# EAGLE design BrainA2-A-24Sep2016 (EAGLE 7.5.0)
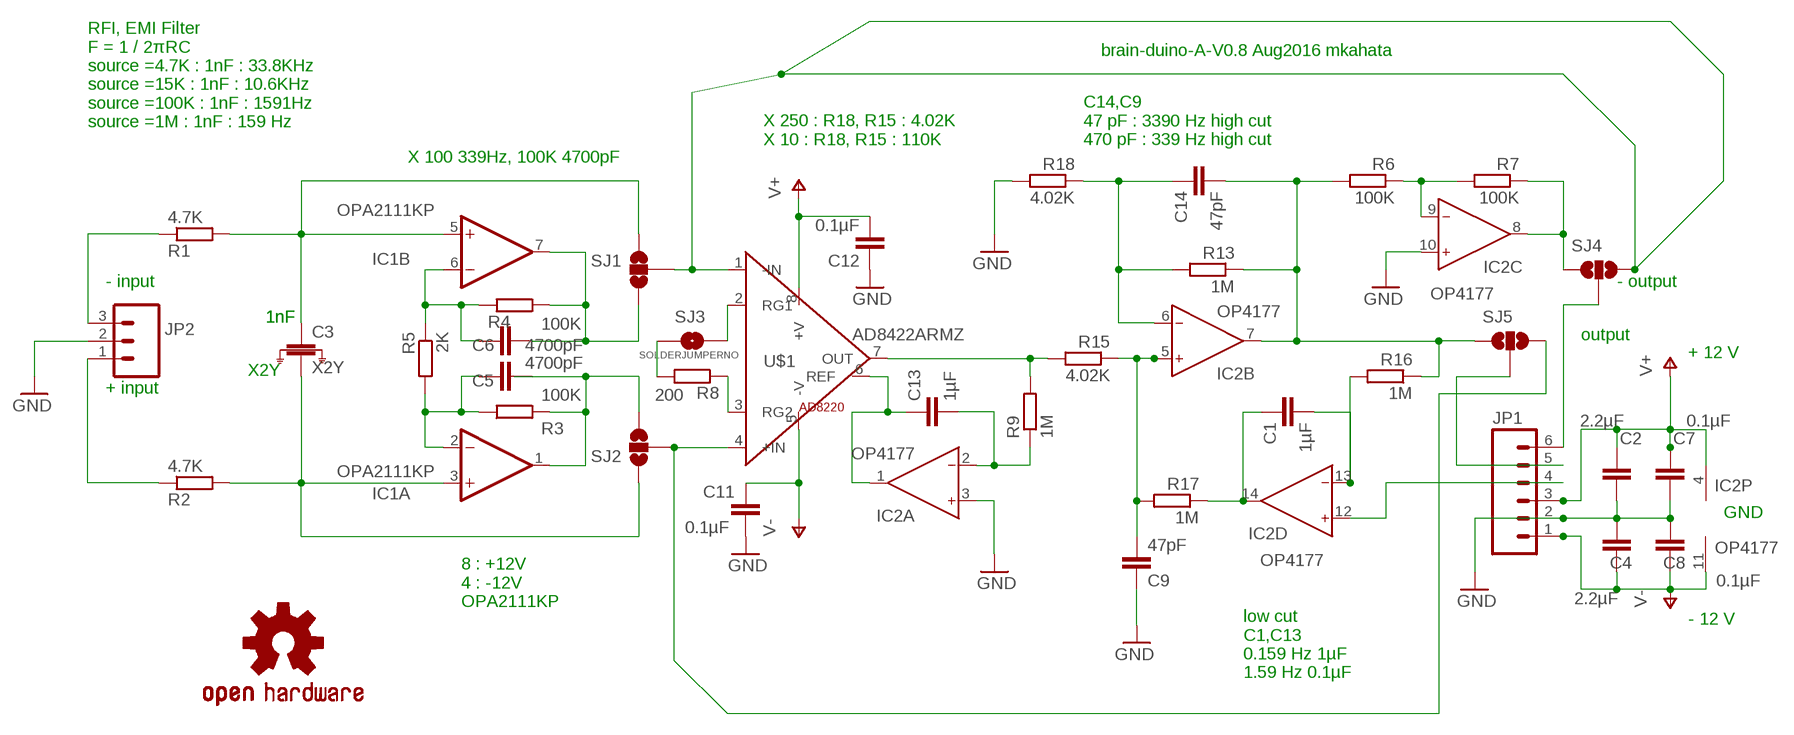
[diagram p0: schematic, sheet 1]

## Parts
C1  1µF  C-EUC0402  [C0402]
C2  2.2µF  C-EUC0402  [C0402]
C3  X2Y  C-EUX2Y  [C0603]
C4  2.2µF  C-EUC0402  [C0402]
C5  4700pF  C-EUC0402  [C0402]
C6  4700pF  C-EUC0402  [C0402]
C7  0.1µF  C-EUC0402  [C0402]
C8  0.1µF  C-EUC0402  [C0402]
C9  47pF  C-EUC0402  [C0402]
C11  0.1µF  C-EUC0402  [C0402]
C12  0.1µF  C-EUC0402  [C0402]
C13  1µF  C-EUC0402  [C0402]
C14  47pF  C-EUC0402  [C0402]
IC1  OPA2111KP  OPA2111P  [DIL08]
IC2  OP4177  AD8544RU  [TSSOP14]
JP1  M06SILK_FEMALE_PTH  [1X06]
JP2  M03PTH  [1X03]
LOGO1  OSHW-LOGOS  [OSHW-LOGO-S]
R1  4.7K  R-EU_R0402  [R0402]
R2  4.7K  R-EU_R0402  [R0402]
R3  100K  R-EU_R0402  [R0402]
R4  100K  R-EU_R0402  [R0402]
R5  2K  R-EU_R0402  [R0402]
R6  100K  R-EU_R0402  [R0402]
R7  100K  R-EU_R0402  [R0402]
R8  200  R-EU_R0402  [R0402]
R9  1M  R-EU_R0402  [R0402]
R13  1M  R-EU_R0402  [R0402]
R15  4.02K  R-EU_R0402  [R0402]
R16  1M  R-EU_R0402  [R0402]
R17  1M  R-EU_R0402  [R0402]
R18  4.02K  R-EU_R0402  [R0402]
SJ1  SOLDERJUMPER_2WAYPASTE2&3  [SJ_3_PASTE2&3]
SJ2  SOLDERJUMPER_2WAYPASTE2&3  [SJ_3_PASTE2&3]
SJ3  SOLDERJUMPERNO  [SJ_2S-NO]
SJ4  SOLDERJUMPER_2WAYPASTE2&3  [SJ_3_PASTE2&3]
SJ5  SOLDERJUMPER_2WAYPASTE2&3  [SJ_3_PASTE2&3]
U$1  AD8422ARMZ  AD8220  [AD8220]

## Nets
GND: C2.1 C4.2 C7.1 C8.2 C9.1 C11.2 C12.1 IC2.3(A:IN+) IC2.10(C:IN+) JP1.2 JP2.2 R18.2
N$1: JP2.3 R1.1
N$2: R8.2 SJ3.1
N$3: JP2.1 R2.1
N$4: C3.2 IC1.3(A:+IN) R2.2 SJ2.1
N$5: C3.1 IC1.5(B:+IN) R1.2 SJ1.1
N$6: IC2.9(C:IN-) R6.1 R7.2
N$8: C5.1 IC1.2(A:-IN) R3.1 R5.2
N$9: C6.1 IC1.6(B:-IN) R4.1 R5.1
N$14: SJ1.2 SJ4.1 U$1.1(-IN)
N$15: SJ2.2 SJ5.1 U$1.4(+IN)
N$17: C5.2 IC1.1(A:OUT) R3.2 SJ2.3
N$18: C6.2 IC1.7(B:OUT) R4.2 SJ1.3
N$19: R8.1 U$1.3(RG2)
N$20: JP1.6 SJ4.2
N$21: C1.2 IC2.13(D:IN-) R16.2
N$23: SJ3.2 U$1.2(RG1)
N$24: C9.2 IC2.5(B:IN+) R15.1 R17.2
N$25: R9.2 R15.2 U$1.7(OUT)
N$26: C13.2 IC2.2(A:IN-) R9.1
N$29: C14.2 IC2.7(B:OUT) R6.2 R13.1 R16.1 SJ5.3
N$30: C13.1 IC2.1(A:OUT) U$1.6(REF)
N$31: C14.1 IC2.6(B:IN-) R13.2 R18.1
N$34: IC2.12(D:IN+) JP1.4
N$35: C1.1 IC2.14(D:OUT) R17.1
N$36: IC2.8(C:OUT) R7.1 SJ4.3
N$38: JP1.5 SJ5.2
V+: C2.2 C7.2 C12.2 IC2.4(P:V+) JP1.3 U$1.8(+V)
V-: C4.1 C8.1 C11.1 IC2.11(P:V-) JP1.1 U$1.5(-V)

## Notes on the sheet
- brain-duino-A-V0.8 Aug2016 mkahata
- RFI, EMI Filter
  F = 1 / 2πRC
  source =4.7K : 1nF : 33.8KHz
  source =15K : 1nF : 10.6KHz
  source =100K : 1nF : 1591Hz
  source =1M : 1nF : 159 Hz
- X 250 : R18, R15 : 4.02K
  X 10 : R18, R15 : 110K
- C14,C9
  47 pF : 3390 Hz high cut
  470 pF : 339 Hz high cut
- X 100 339Hz, 100K 4700pF
- - input | - output
- 1nF | 1nF
- output
- + 12 V
- X2Y
- + input
- GND
- 8 : +12V
  4 : -12V
  OPA2111KP
- - 12 V
- low cut
  C1,C13
  0.159 Hz 1µF
  1.59 Hz 0.1µF

## Power pins joined to a net without a drawn wire
GND: C3.GND
V+: IC1.8(P:V+)
V-: IC1.4(P:V-)

## Library data of the parts
C1 C2 C4-C9 C11-C14 = resistor:C-EU: CAPACITOR, European symbol
C3 = AD7173:C-EU: CAPACITOR, European symbol
IC1 = linear:OPA2111: OP AMP
IC2 = analog-devices:AD8544: General-Purpose CMOS Rail-to-Rail Amplifiers Source: http://www.analog.com/static/imported-files/data_sheets/AD8541_8542_8544.pdf; MPN: AD8544ARUZ; OC_FARNELL: unknown; OC_NEWARK: 15P1001
JP1 = SparkFun-Connectors:M06: Header 6 Standard 6-pin 0.1" header. Use with straight break away headers (SKU : PRT-00116), right angle break away headers (PRT-00553), swiss pins (PRT-00743), machine pins (PRT-00117), and female headers (PRT-00115). Molex polarized connector foot print use with SKU : PRT-08094 with associated crimp pins and housings. NOTES ON THE VARIANTS LOCK and LOCK_LONGPADS... This footprint was designed to help hold the alignment of a through-hole component (i.e. 6-pin header) while soldering it into place. You may notice that each hole has been shifted either up or down by 0.005 of an inch from it's more standard position (which is a perfectly straight line). This slight alteration caused the pins (the squares in the middle) to touch the edges of the holes. Because they are alternating, it causes a "brace" to hold the component in place. 0.005 has proven to be the perfect amount of "off-center" position when using our standard breakaway headers. Although looks a little odd when you look at the bare footprint, once you have a header in there, the alteration is very hard to notice. Also,if you push a header all the way into place, it is covered up entirely on the bottom side. This idea of altering the position of holes to aid alignment will be further integrated into the Sparkfun Library for other footprints. It can help hold any component with 3 or more connection pins.; PROD_ID: CONN-08437
JP2 = SparkFun-Connectors:M03: Header 3 Standard 3-pin 0.1" header. Use with straight break away headers (SKU : PRT-00116), right angle break away headers (PRT-00553), swiss pins (PRT-00743), machine pins (PRT-00117), and female headers (PRT-00115). Molex polarized connector foot print use with SKU : PRT-08232 with associated crimp pins and housings.
LOGO1 = SparkFun-Aesthetics:OSHW-LOGO: Open Source Hardware Logo This logo indicates the piece of hardware it is found on incorporates a OSHW license and/or adheres to the definition of open source hardware found here: http://freedomdefined.org/OSHW
R1-R9 R13 R15-R18 = resistor:R-EU_: RESISTOR, European symbol
SJ1 SJ2 SJ4 SJ5 = SparkFun-Retired:SOLDERJUMPER_2WAY: Solder Jumper 2 way solder jumper
SJ3 = SparkFun-Retired:SOLDERJUMPER: Solder Jumper Standard SMD solder jumper. Used to automate production. Two varients : Normally Open and Normally Closed are the same, but have different paste layers. NC will have a large amount of paste and should jumper during reflow.
U$1 = MKH:AD8220: IN-AMP{

## Net classes
0 default: clearance 0.205 mm

## Board
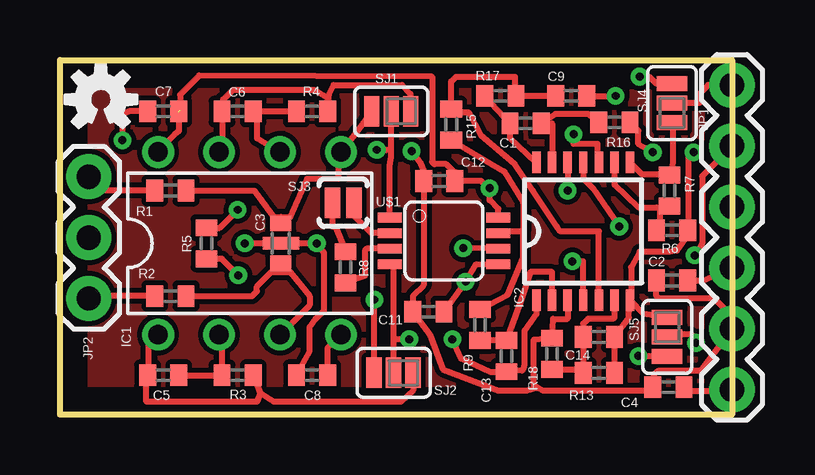
[diagram p1: board, top side]
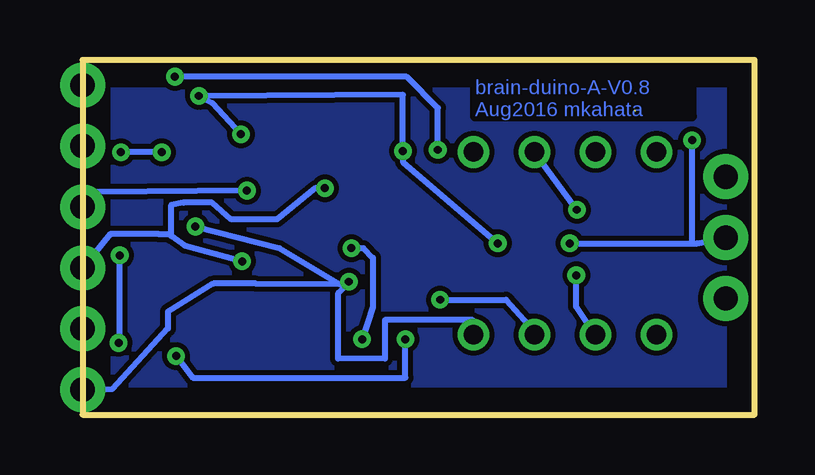
[diagram p2: board, bottom side, seen from below]

Size 28 x 14.8 mm. Coordinates in mm from the lower left corner, seen from the top.
Outline: 0,14.8 28,14.8 28,0 0,0 0,14.8
Copper layers (1*16): Top 0.035mm / dielectric 1.5mm / Bottom 0.035mm
Design rules "default *": minimum track width 10mil, minimum drill 24mil, track to track 8mil, track to pad 8mil, pad to pad 8mil, via to via 8mil, smd to smd 8mil, copper to edge 40mil, drill to drill 8mil, minimum pad ring 10mil, minimum via ring 8mil, stop-mask expansion 4mil, vias tented up to drill 0mil, thermal gap 10mil

### Footprints (pad centres in the part's own frame; a part is rotated, then mirrored left to right if it is on the bottom)
C0402 = smd 0.7 x 0.9: 1 -0.65,0; 2 0.65,0
C0603 = smd 0.64 x 0.89: 1 -0.83,0; 2 0.83,0 | smd 0.51 x 1.52: GND 0,0
DIL08 = drill 0.813 pad 1.27: 1 -3.81,-3.81; 2 -1.27,-3.81; 3 1.27,-3.81; 4 3.81,-3.81; 5 3.81,3.81; 6 1.27,3.81; 7 -1.27,3.81; 8 -3.81,3.81
TSSOP14 = smd 0.9 x 0.35: 1 -2.875,1.95; 2 -2.875,1.3; 3 -2.875,0.65; 4 -2.875,0; 5 -2.875,-0.65; 6 -2.875,-1.3; 7 -2.875,-1.95; 8 2.875,-1.95; 9 2.875,-1.3; 10 2.875,-0.65; 11 2.875,0; 12 2.875,0.65; 13 2.875,1.3; 14 2.875,1.95
1X06 = drill 1.016 pad 1.88: 1 0,0; 2 2.54,0; 3 5.08,0; 4 7.62,0; 5 10.16,0; 6 12.7,0
1X03 = drill 1.016 pad 1.88: 1 0,0; 2 2.54,0; 3 5.08,0
R0402 = smd 0.7 x 0.9: 1 -0.65,0; 2 0.65,0
SJ_3_PASTE2&3 = smd 0.635 x 1.27: 1 -0.813,0; 2 0,0; 3 0.813,0
SJ_2S-NO = smd 0.635 x 1.27: 1 -0.45,0; 2 0.45,0
AD8220 = smd 0.4 x 1: 1 -0.976,-2.263; 2 -0.326,-2.263; 3 0.324,-2.263; 4 0.974,-2.263; 5 0.974,2.262; 6 0.324,2.262; 7 -0.326,2.262; 8 -0.976,2.262

### Placement (x,y rotation side)
C1  19.4,12.15 0 top
C2  25.5,5.6 0 top
C3  9.2,7.15 270 top
C4  25.35,1.15 180 top
C5  4.3,1.65 180 top
C6  7.4,12.65 180 top
C7  4.3,12.65 0 top
C8  10.5,1.65 180 top
C9  21.3,13.3 180 top
C11  15.35,4.3 180 top
C12  15.8,9.75 0 top
C13  18.6,2.45 90 top
C14  22.45,3.25 0 top
IC1  7.9,7.15 0 top
IC2  21.8,7.65 90 top
JP1  28,1.05 90 top
JP2  1.2,4.85 90 top
LOGO1  1.7,13.15 0 top
R1  4.6,9.35 0 top
R2  4.6,4.95 0 top
R3  7.4,1.65 0 top
R4  10.5,12.65 0 top
R5  6.1,7.15 270 top
R6  25.5,7.7 0 top
R7  25.4,9.35 270 top
R8  11.9,6.15 90 top
R9  17.5,3.75 90 top
R13  22.45,1.75 180 top
R15  16.3,12.1 270 top
R16  23.1,12.2 180 top
R17  18.35,13.3 0 top
R18  20.5,2.55 90 top
SJ1  13.8,12.65 0 top
SJ2  13.9,1.75 0 top
SJ3  11.8,8.85 0 top
SJ4  25.5,13 270 top
SJ5  25.3,3.25 90 top
U$1  16,7.25 270 top

### Tracks (layer width: path | path; a pad name or v marks a point on that pad's centre or on a via)
GND  (via drill 0.33)
  Top 0.254: IC2.3 21.15,4 20.55,4 R18.2 19.74,3.14 19.74,1.23 | 19.74,1.23 19.87,1.12 19.45,1 18.3,1 15.95,1.9 15.4,3.35 C11.2 14.7,4.95 15.15,5.4 C12.1 15.15,10.2 15.05,10.45 v14.65,11 | v2.6,11.45 2.6,12.55 2.92,12.67 3.47,12.67 3.49,12.65 C7.1 | IC2.10 22.45,10.7 22.4,10.75 22.4,11.3 21.4,11.3 v21.4,11.7 21.4,11.75 | C8.2 10.4,2.65 10.4,3.65 10.65,4 11,4.35 11,6.75 v10.7,7.15 C3.GND v7.7,7.15 | 19.74,1.23 20.12,1 24.55,1 24.7,1.2 C4.2 24.75,1.7 24.95,1.85 26.71,1.85 JP1.2 28,4.1 27.25,4.85 24.95,4.85 24.85,4.95 C2.1 | C9.1 v23.15,13.3
  Bottom 0.254: 2.6,7.15 v2.6,11.45 | v7.7,7.15 2.6,7.15 | 2.6,7.15 2.4,7.15 JP2.2 | v10.7,7.15 14.65,10.55 v14.65,11 14.65,13.35 v23.15,13.3 22.6,13 v21.4,11.7
N$1
  Top 0.254: R1.1 1.74,9.35 1.36,9.63 JP2.3
N$2
  Top 0.254: R8.2 11.49,7.81 11.35,7.85 SJ3.1
N$3
  Top 0.254: R2.1 1.74,4.95 1.5,4.91 JP2.1
N$4  (via drill 0.33)
  Top 0.254: 9.2,5.95 8.8,5.95 8.2,5.35 8.2,5.15 8,4.95 R2.2 | 9.2,5.95 9.6,5.95 10.4,4.95 10.4,4.57 IC1.3 | C3.2 9.2,5.95 | SJ2.1 13.09,3.66 v13.1,4.8
  Bottom 0.254: v13.1,4.8 10.35,4.8 9.4,3.75 9.2,3.57 IC1.3
N$5
  Top 0.254: R1.2 8.1,9.35 8.9,8.25 9.2,8.25 | 9.2,8.25 9.6,8.25 10.3,9.85 11.6,9.85 11.6,10.85 IC1.5 12.4,11.85 SJ1.1 | C3.1 9.2,8.25
N$6
  Top 0.254: IC2.9 23.1,9.6 24.1,8.65 24.85,8.65 R7.2 25,8.5 25,7.4 R6.1
N$8  (via drill 0.33)
  Top 0.254: C5.1 R3.1 6.75,3.02 IC1.2 | v7.43,5.81 6.74,6.5 R5.2
  Bottom 0.254: IC1.2 7.43,4.51 v7.43,5.81
N$9  (via drill 0.33)
  Top 0.254: 9.02,11.05 IC1.6 8.97,11.06 8.22,11.52 8.22,12.61 C6.1 R4.1 | R5.1 6.65,7.8 v7.4,8.55
  Bottom 0.254: v7.4,8.55 7.46,8.6 IC1.6
N$10
  pour Bottom: 0,14.8 28,14.8 28,0 0,0
N$11
  pour Top: 0,14.8 28,14.8 28,0 0,0
N$14  (via drill 0.33)
  Top 0.254: U$1.1 13.74,10.39 13.8,10.75 13.8,11.1 | 13.8,11.1 SJ1.2 | SJ4.1 24.84,13.81 24.55,14.1 v24.15,14.1 | v13.2,11.05 13.6,11.05 13.8,11.1
  Bottom 0.254: v13.2,11.05 13.2,12.8 14.5,14.1 v24.15,14.1
N$15  (via drill 0.33)
  Top 0.254: SJ2.2 13.9,3.15 | 13.9,3.15 13.9,6.11 U$1.4 | v14.55,3.15 13.9,3.15 | v24.1,2.45 25.29,2.45 SJ5.1
  Bottom 0.254: v24.1,2.45 23.4,1.55 14.55,1.55 v14.55,3.15
N$17
  Top 0.254: R3.2 8.35,0.9 | 8.35,0.9 8.2,0.55 3.6,0.55 3.6,1.5 C5.2 3.65,1.93 3.68,1.93 3.7,1.95 3.7,2.95 IC1.1 | 8.35,0.9 8.9,0.55 14.2,0.55 14.71,1.01 SJ2.3
N$18
  Top 0.254: 6.91,12.44 C6.2 | C6.2 6.8,12.5 6.8,13.15 7.2,13.55 10.6,13.55 11.15,13.2 R4.2 11.2,12.65 11.2,13.35 11.4,13.75 14.25,13.75 14.6,13.39 SJ1.3 | C6.2 6.75,11.08 IC1.7
N$19
  Top 0.254: U$1.3 12.78,6.93 12.7,6.85 12.7,5.8 11.95,5.55 R8.1
N$20
  Top 0.254: JP1.6 27,13.75 26.65,13.4 26.65,13 SJ4.2
N$21
  Top 0.254: IC2.13 20.5,12.15 C1.2 20.65,12.55 22,12.55 R16.2
N$23
  Top 0.254: U$1.2 12.97,7.58 12.3,8.25 12.3,8.45 | 12.3,8.45 12.3,9.04 | SJ3.2 12.35,8.5 12.3,8.45
N$24
  Top 0.254: IC2.5 22.45,7.65 20.85,7.65 20.7,7.85 19.7,9.35 18.95,10.45 17.55,11.65 17.05,12.6 16.45,12.6 | C9.2 R17.2 19.1,13.5 18.95,13.8 18.95,14.1 16.5,14.1 16.3,13.9 16.3,12.65 16.35,12.6 16.45,12.6 | 16.45,12.6 R15.1
N$25
  Top 0.254: 19.3,7.65 18.34,7.65 U$1.7 | R9.2 18.65,5 19.3,6.55 19.3,7.65 | R15.2 18.5,10.15 19.3,8.85 19.3,7.65
N$26
  Top 0.254: IC2.2 20.5,5.95 19.6,5.95 19.2,4.75 C13.2 R9.1
N$29  (via drill 0.33)
  Top 0.254: R13.1 C14.2 23.7,4.05 23.7,4.33 IC2.7 | IC2.7 23.8,4.83 23.8,6.15 24.15,6.8 25.4,6.8 25.7,6.85 26.15,7.5 R6.2 26.2,7.5 26.2,10.9 v26.4,10.95 | v24.7,10.95 24.1,11.3 24.1,11.85 R16.1 | IC2.7 24.31,4.21 SJ5.3
  Bottom 0.254: v24.7,10.95 v26.4,10.95
N$30  (via drill 0.33)
  Top 0.254: U$1.6 17.88,6.93 16.9,6.95 v16.8,6.95 | v16.35,3.15 16.7,2.35 17.9,1.8 C13.1 | 18.85,1.75 C13.1 | IC2.1 19.85,4.2 19.35,3.5 19.35,2.1 19.3,1.9 19.25,1.85 C13.1
  Bottom 0.254: v16.35,3.15 15.9,4.5 15.9,6.55 16.3,6.95 v16.8,6.95
N$31
  Top 0.254: R18.1 21.5,1.9 R13.2 C14.1 21.8,3.8 22,4 23.05,4 23.1,4.05 IC2.6
N$34  (via drill 0.33)
  Top 0.254: IC2.12 v21.15,9.35
  Bottom 0.254: v21.15,9.35 27.37,9.3 JP1.4
N$35
  Top 0.254: R17.1 C1.1 18.75,11.55 IC2.14
N$36
  Top 0.254: 25.28,10.02 25.53,10.33 25.55,10.6 25.55,12.14 SJ4.3 | 25.28,10.02 24.25,10.02 IC2.8 | R7.1 25.3,10 25.28,10.02
N$38  (via drill 0.33 pad 0.25)
  Top 0.254: JP1.5 26.75,9.95 26.75,7.15 26.6,6.8 v26.45,6.65 | v26.5,3 26.5,3.15 26.3,3.35 25.6,3.35 SJ5.2
  Bottom 0.254: v26.5,3 26.45,3.15 v26.45,6.65
V+  (via drill 0.33)  (1 unrouted)
  Top 0.254: IC1.8 4.16,11.06 4.78,11.7 4.95,11.83 C7.2 | U$1.8 18.26,8.59 17.9,8.95 v17.9,9.45 17.85,9.45 17.55,9.75 C12.2 16.45,10.1 | 5,12.7 5,13.35 5.8,14.15 15.5,14.1 15.5,10.55 15.6,10.45 16.1,10.45 16.45,10.1 | IC2.4 21.8,6.4 v21.35,6.4 | C2.2 26.82,5.6 JP1.3 | 16.55,10.1 16.45,10.1
  Bottom 0.254: v21.35,6.4 23.73,7.05 24.3,7.45 | v17.9,9.45 18.3,9.45 19.9,8.15 21.8,8.15 22.6,8.85 23.8,8.85 24.3,8.75 24.3,7.45 | 24.3,7.45 24.4,7.55 24.82,7.53 26.85,7.53 JP1.3
V-  (via drill 0.33)
  Top 0.254: C11.1 v16.9,5.55 17.35,6.29 U$1.5 | v23.3,7.85 22.2,9.45 21.8,9.85 IC2.11 | C4.1 25.9,0.99 27.94,0.99 JP1.1 | C8.1 11.15,2.78 IC1.4
  Bottom 0.254: IC1.4 11.75,3.34 11.75,3.95 15.4,3.95 15.4,2.35 17.35,2.34 17.34,5.09 v16.9,5.55 17.3,5.45 | v23.3,7.85 19.8,6.95 17.3,5.45 | 17.3,5.45 20.78,5.47 22.55,5.47 24.45,4.3 24.45,3.6 26.77,1.07 JP1.1

### Text on the board
Bottom: brain-duino-A-V0.8 / Aug2016 mkahata